# Altium schematic sheet FPGAPower.SchDoc
size 420 x 297 mm; Organization: Altium Limited; Address1: L3, 12a Rodborough Rd; Address2: Frenchs Forest; Address3: NSW; Address4: Australia 2086
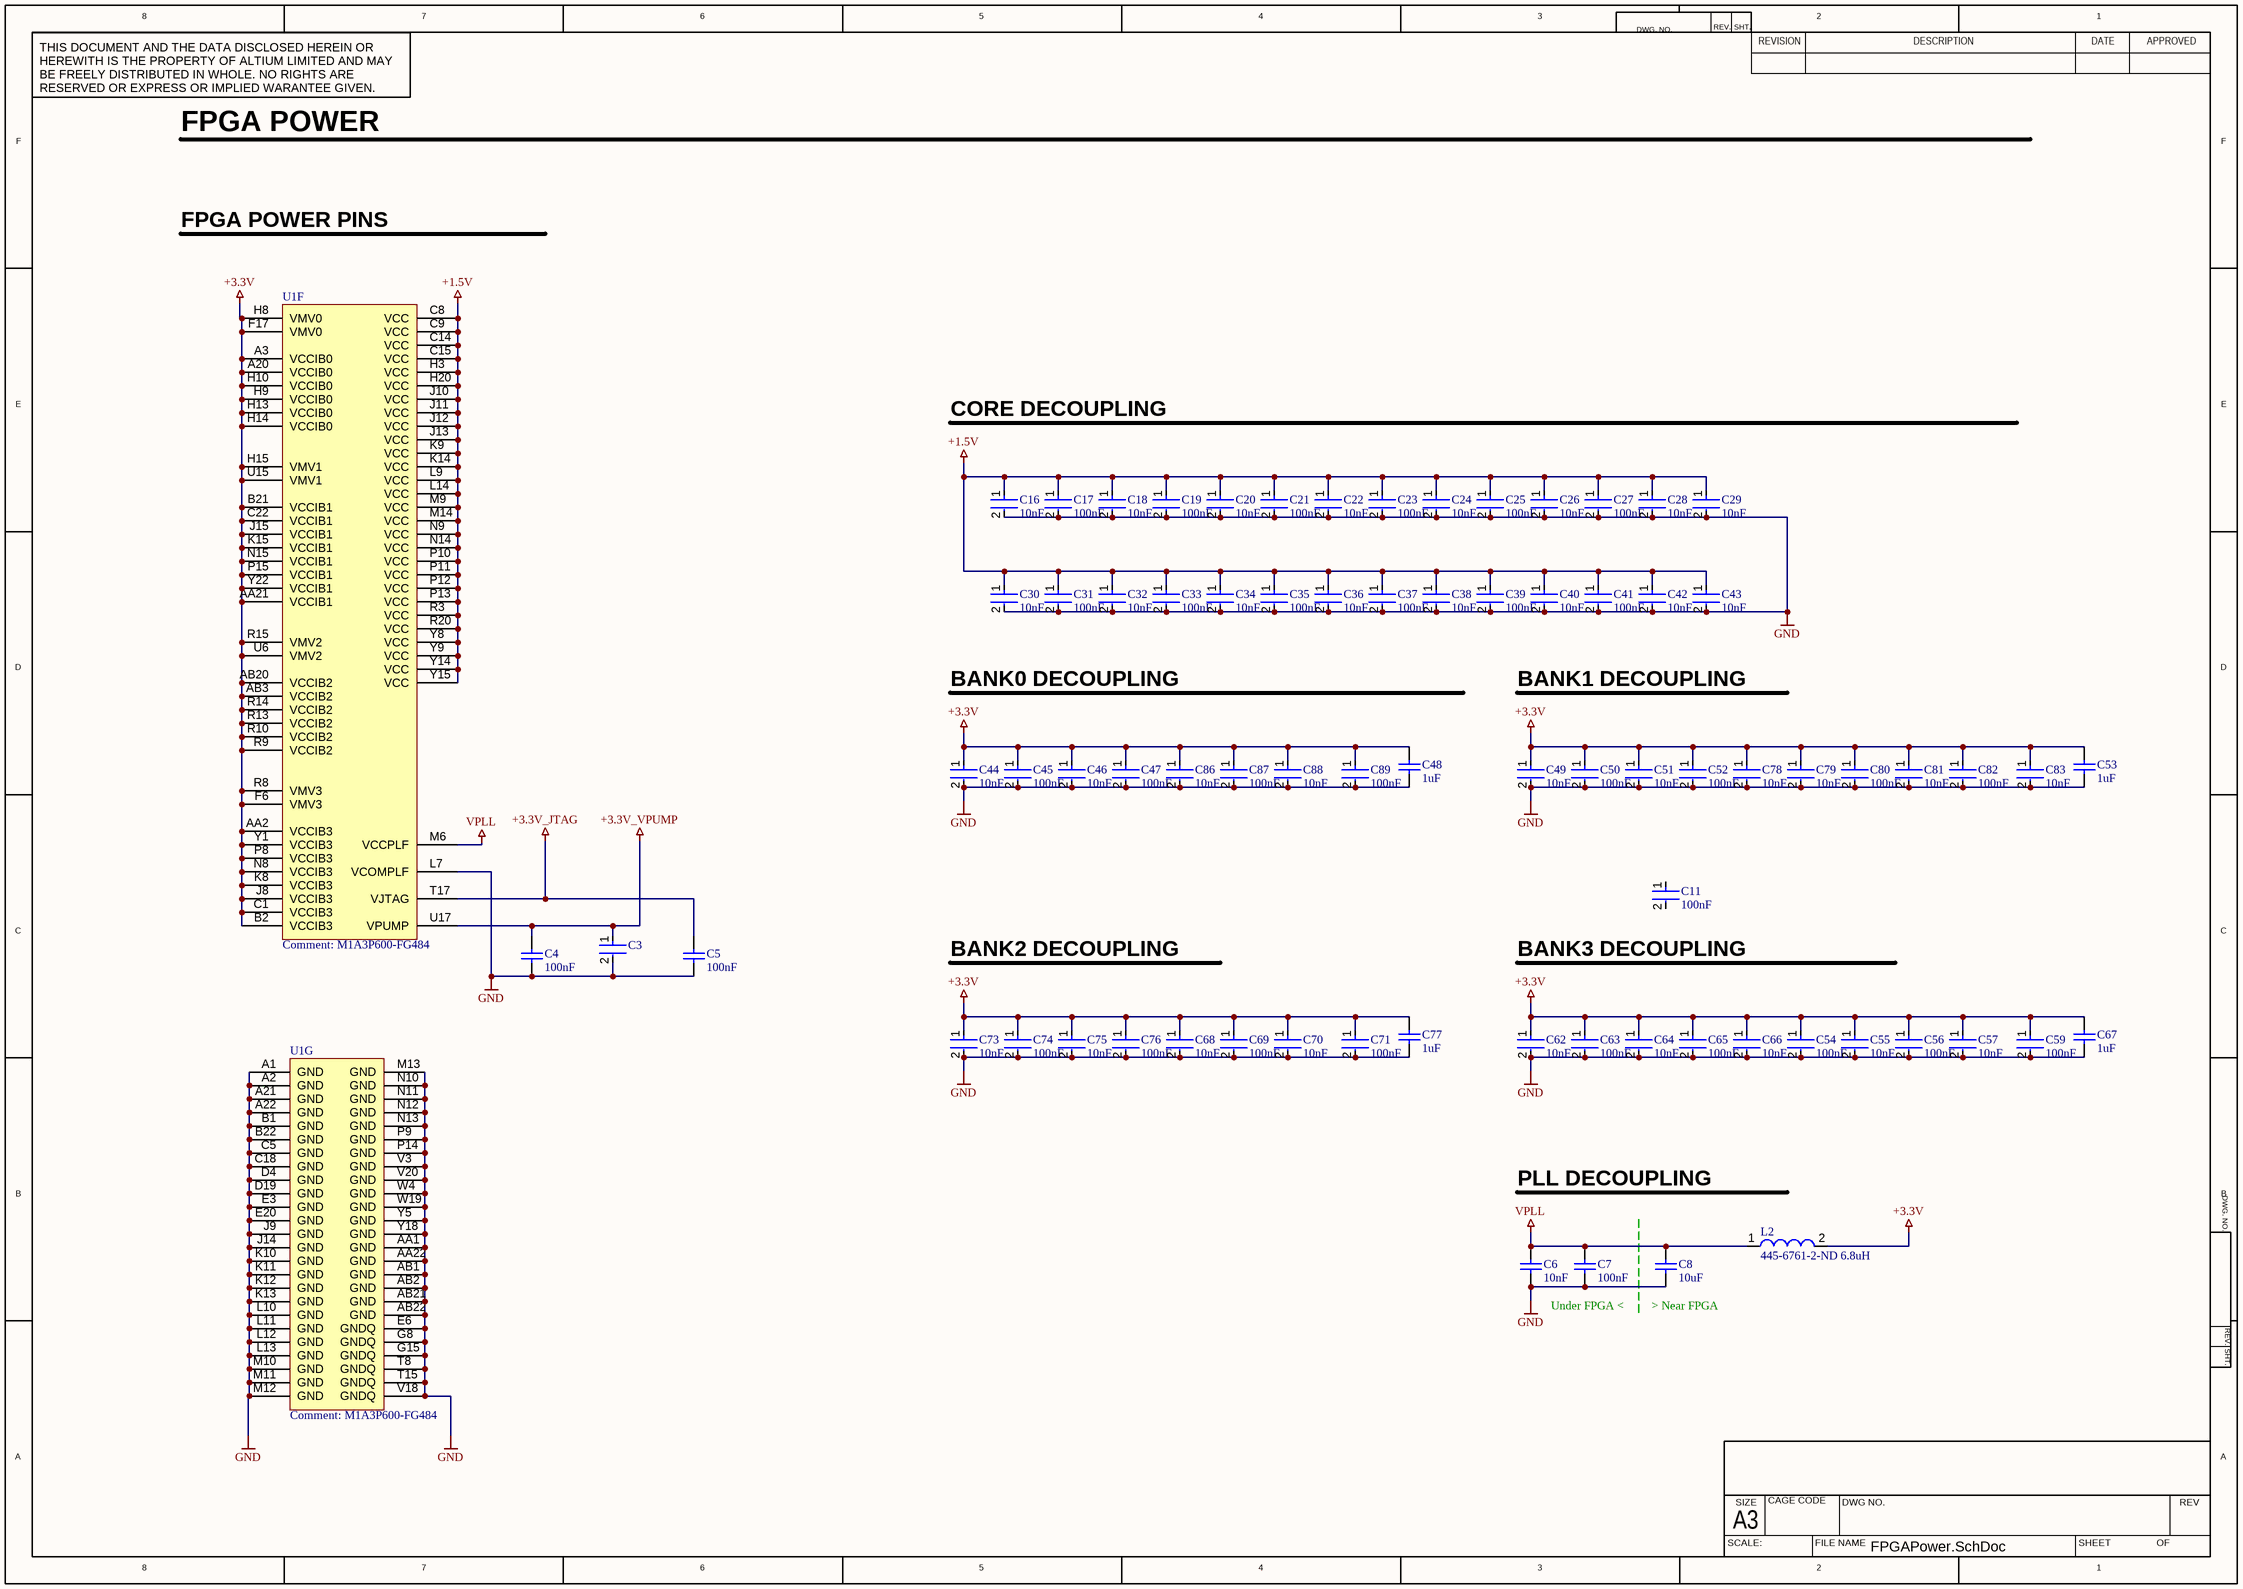
[diagram p0: FPGAPower.SchDoc]

## Parts
C3  CC0402KRX5R6BB334  [FP-CC0402-MFG]  (value not drawn)
C4  100nF  [CAPC1005X60X30ML05T10]
C5  100nF  [CAPC1005X60X30ML05T10]
C6  10nF  [CAPC0402(1005)60_M]
C7  100nF  [CAPC1005X60X30ML05T10]
C8  10uF  [CAPC2013X145X20ML20]
C11  100nF  [FP-GRM155-0_05-IPC_C]
C16  10nF  [FP-GRM155-0_05-IPC_C]
C17  100nF  [FP-GRM155-0_05-IPC_C]
C18  10nF  [FP-GRM155-0_05-IPC_C]
C19  100nF  [FP-GRM155-0_05-IPC_C]
C20  10nF  [FP-GRM155-0_05-IPC_C]
C21  100nF  [FP-GRM155-0_05-IPC_C]
C22  10nF  [FP-GRM155-0_05-IPC_C]
C23  100nF  [FP-GRM155-0_05-IPC_C]
C24  10nF  [FP-GRM155-0_05-IPC_C]
C25  100nF  [FP-GRM155-0_05-IPC_C]
C26  10nF  [FP-GRM155-0_05-IPC_C]
C27  100nF  [FP-GRM155-0_05-IPC_C]
C28  10nF  [FP-GRM155-0_05-IPC_C]
C29  10nF  [FP-GRM155-0_05-IPC_C]
C30  10nF  [FP-GRM155-0_05-IPC_C]
C31  100nF  [FP-GRM155-0_05-IPC_C]
C32  10nF  [FP-GRM155-0_05-IPC_C]
C33  100nF  [FP-GRM155-0_05-IPC_C]
C34  10nF  [FP-GRM155-0_05-IPC_C]
C35  100nF  [FP-GRM155-0_05-IPC_C]
C36  10nF  [FP-GRM155-0_05-IPC_C]
C37  100nF  [FP-GRM155-0_05-IPC_C]
C38  10nF  [FP-GRM155-0_05-IPC_C]
C39  100nF  [FP-GRM155-0_05-IPC_C]
C40  10nF  [FP-GRM155-0_05-IPC_C]
C41  100nF  [FP-GRM155-0_05-IPC_C]
C42  10nF  [FP-GRM155-0_05-IPC_C]
C43  10nF  [FP-GRM155-0_05-IPC_C]
C44  10nF  [FP-GRM155-0_05-IPC_C]
C45  100nF  [FP-GRM155-0_05-IPC_C]
C46  10nF  [FP-GRM155-0_05-IPC_C]
C47  100nF  [FP-GRM155-0_05-IPC_C]
C48  1uF  [CAPC1608X90X20LL10]
C49  10nF  [FP-GRM155-0_05-IPC_C]
C50  100nF  [FP-GRM155-0_05-IPC_C]
C51  10nF  [FP-GRM155-0_05-IPC_C]
C52  100nF  [FP-GRM155-0_05-IPC_C]
C53  1uF  [CAPC1608X90X20LL10]
C54  100nF  [FP-GRM155-0_05-IPC_C]
C55  10nF  [FP-GRM155-0_05-IPC_C]
C56  100nF  [FP-GRM155-0_05-IPC_C]
C57  10nF  [FP-GRM155-0_05-IPC_C]
C59  100nF  [FP-GRM155-0_05-IPC_C]
C62  10nF  [FP-GRM155-0_05-IPC_C]
C63  100nF  [FP-GRM155-0_05-IPC_C]
C64  10nF  [FP-GRM155-0_05-IPC_C]
C65  100nF  [FP-GRM155-0_05-IPC_C]
C66  10nF  [FP-GRM155-0_05-IPC_C]
C67  1uF  [CAPC1608X90X20LL10]
C68  10nF  [FP-GRM155-0_05-IPC_C]
C69  100nF  [FP-GRM155-0_05-IPC_C]
C70  10nF  [FP-GRM155-0_05-IPC_C]
C71  100nF  [FP-GRM155-0_05-IPC_C]
C73  10nF  [FP-GRM155-0_05-IPC_C]
C74  100nF  [FP-GRM155-0_05-IPC_C]
C75  10nF  [FP-GRM155-0_05-IPC_C]
C76  100nF  [FP-GRM155-0_05-IPC_C]
C77  1uF  [CAPC1608X90X20LL10]
C78  10nF  [FP-GRM155-0_05-IPC_C]
C79  10nF  [FP-GRM155-0_05-IPC_C]
C80  100nF  [FP-GRM155-0_05-IPC_C]
C81  10nF  [FP-GRM155-0_05-IPC_C]
C82  100nF  [FP-GRM155-0_05-IPC_C]
C83  10nF  [FP-GRM155-0_05-IPC_C]
C86  10nF  [FP-GRM155-0_05-IPC_C]
C87  100nF  [FP-GRM155-0_05-IPC_C]
C88  10nF  [FP-GRM155-0_05-IPC_C]
C89  100nF  [FP-GRM155-0_05-IPC_C]
L2  445-6761-2-ND 6.8uH  [SMD-0805]
U1  M1A3P600-FG484  [FG484]  (parts F,G of 8)

## Nets
+1.5V: C16.1 C17.1 C18.1 C19.1 C20.1 C21.1 C22.1 C23.1 C24.1 C25.1 C26.1 C27.1 C28.1 C29.1 C30.1 C31.1 C32.1 C33.1 C34.1 C35.1 C36.1 C37.1 C38.1 C39.1 C40.1 C41.1 C42.1 C43.1 U1.C8(VCC) U1.C9(VCC) U1.C14(VCC) U1.C15(VCC) U1.H3(VCC) U1.H20(VCC) U1.J10(VCC) U1.J11(VCC) U1.J12(VCC) U1.J13(VCC) U1.K9(VCC) U1.K14(VCC) U1.L9(VCC) U1.L14(VCC) U1.M9(VCC) U1.M14(VCC) U1.N9(VCC) U1.N14(VCC) U1.P10(VCC) U1.P11(VCC) U1.P12(VCC) U1.P13(VCC) U1.R3(VCC) U1.R20(VCC) U1.Y8(VCC) U1.Y9(VCC) U1.Y14(VCC) U1.Y15(VCC)
+3.3V: C44.1 C45.1 C46.1 C47.1 C48.2 C49.1 C50.1 C51.1 C52.1 C53.2 C54.1 C55.1 C56.1 C57.1 C59.1 C62.1 C63.1 C64.1 C65.1 C66.1 C67.2 C68.1 C69.1 C70.1 C71.1 C73.1 C74.1 C75.1 C76.1 C77.2 C78.1 C79.1 C80.1 C81.1 C82.1 C83.1 C86.1 C87.1 C88.1 C89.1 L2.2 U1.A3(VCCIB0) U1.A20(VCCIB0) U1.AA2(VCCIB3) U1.AA21(VCCIB1) U1.AB3(VCCIB2) U1.AB20(VCCIB2) U1.B2(VCCIB3) U1.B21(VCCIB1) U1.C1(VCCIB3) U1.C22(VCCIB1) U1.F6(VMV3) U1.F17(VMV0) U1.H8(VMV0) U1.H9(VCCIB0) U1.H10(VCCIB0) U1.H13(VCCIB0) U1.H14(VCCIB0) U1.H15(VMV1) U1.J8(VCCIB3) U1.J15(VCCIB1) U1.K8(VCCIB3) U1.K15(VCCIB1) U1.N8(VCCIB3) U1.N15(VCCIB1) U1.P8(VCCIB3) U1.P15(VCCIB1) U1.R8(VMV3) U1.R9(VCCIB2) U1.R10(VCCIB2) U1.R13(VCCIB2) U1.R14(VCCIB2) U1.R15(VMV2) U1.U6(VMV2) U1.U15(VMV1) U1.Y1(VCCIB3) U1.Y22(VCCIB1)
+3.3V_JTAG: C5.2 U1.T17(VJTAG)
+3.3V_VPUMP: C3.1 C4.2 U1.U17(VPUMP)
GND: C3.2 C4.1 C5.1 C6.1 C7.1 C8.1 C16.2 C17.2 C18.2 C19.2 C20.2 C21.2 C22.2 C23.2 C24.2 C25.2 C26.2 C27.2 C28.2 C29.2 C30.2 C31.2 C32.2 C33.2 C34.2 C35.2 C36.2 C37.2 C38.2 C39.2 C40.2 C41.2 C42.2 C43.2 C44.2 C45.2 C46.2 C47.2 C48.1 C49.2 C50.2 C51.2 C52.2 C53.1 C54.2 C55.2 C56.2 C57.2 C59.2 C62.2 C63.2 C64.2 C65.2 C66.2 C67.1 C68.2 C69.2 C70.2 C71.2 C73.2 C74.2 C75.2 C76.2 C77.1 C78.2 C79.2 C80.2 C81.2 C82.2 C83.2 C86.2 C87.2 C88.2 C89.2 U1.A1(GND) U1.A2(GND) U1.A21(GND) U1.A22(GND) U1.AA1(GND) U1.AA22(GND) U1.AB1(GND) U1.AB2(GND) U1.AB21(GND) U1.AB22(GND) U1.B1(GND) U1.B22(GND) U1.C5(GND) U1.C18(GND) U1.D4(GND) U1.D19(GND) U1.E3(GND) U1.E6(GNDQ) U1.E20(GND) U1.G8(GNDQ) U1.G15(GNDQ) U1.J9(GND) U1.J14(GND) U1.K10(GND) U1.K11(GND) U1.K12(GND) U1.K13(GND) U1.L7(VCOMPLF) U1.L10(GND) U1.L11(GND) U1.L12(GND) U1.L13(GND) U1.M10(GND) U1.M11(GND) U1.M12(GND) U1.M13(GND) U1.N10(GND) U1.N11(GND) U1.N12(GND) U1.N13(GND) U1.P9(GND) U1.P14(GND) U1.T8(GNDQ) U1.T15(GNDQ) U1.V3(GND) U1.V18(GNDQ) U1.V20(GND) U1.W4(GND) U1.W19(GND) U1.Y5(GND) U1.Y18(GND)
VPLL: C6.2 C7.2 C8.2 L2.1 U1.M6(VCCPLF)

Not connected (* = marked no-connect by the designer): C11 1 2

## Notes on the sheet
- FPGA POWER
- FPGA POWER PINS
- CORE DECOUPLING
- BANK0 DECOUPLING
- BANK1 DECOUPLING
- BANK2 DECOUPLING
- (near C11) BANK3 DECOUPLING
- PLL DECOUPLING
- Under FPGA <
- (near C8) > Near FPGA
- 8
- 7
- 6
- 5
- 4
- 3
- DWG. NO.
- REV.
- SHT.
- REVISION
- 2
- DESCRIPTION
- DATE
- 1
- APPROVED
- THIS DOCUMENT AND THE DATA DISCLOSED HEREIN OR HEREWITH IS THE PROPERTY OF ALTIUM LIMITED AND MAY BE FREELY DISTRIBUTED IN WHOLE. NO RIGHTS ARE RESERVED OR EXPRESS OR IMPLIED WARANTEE GIVEN.
- F
- E
- D
- C
- B
- A
- SCALE:
- A3
- SIZE
- CAGE CODE
- FILE NAME
- DWG NO.
- SHEET
- OF
- REV

## Library data of the parts
C3 = CMP-03422-001340-1: CAP CER 0.33UF 10V X5R 0402; Manufacturer: YAGEO; Automotive Grade: NA; Value: 330 nF; Temperature Coefficient: 30ppm/°C; Material: Ceramic; Tolerance: 0.1; ComponentLink2URL: http://www.yageo.com/documents/recent/UPY-GP_NP0_16V-to-50V_16.pdf; Device Class L2: Capacitors; Voltage Rating: 10 V; ComponentLink2Description: Datasheet; Package: CC0402; Device Class L3: Ceramic Capacitors; Digikey Description: CAP CER 0.33UF 10V X5R 0402; Device Class L1: Passive Components; Footprint Url: http://www.yageo.com/exep/pages/download/literatures/UPY-C_GEN_24.pdf; Temperature Characteristic: X5R; Octopart: https://octopart.com/cc0402krx5r6bb334-yageo-21548561; Automotive: No; Temperature: -55°C to +125°C; Lead Free: Yes; Temperature Range Low: -55°C; Height: 0.55mm; Ipc Land Pattern Name: CAPC10050X50; Category: Cap; Capacitance: 330 nF; Manufacturer Part Number: CC0402KRX5R6BB334; RoHS: TRUE; Mouser Description: 0402 330 nF 10 V ±10 % Tolerance X5R SMT Multilayer Ceramic Capacitor; Temperature Range High: +125°C
C4 C5 C7 = CMP-2008-02046-1: Manufacturer: Kemet; Part Number: C0402C104K8PACTU
C6 = CMP-1034-01878-1: CAP 10nF 16V -20% to +80% 0402 (1005 Metric) Thickness 0.6mm SMD; Case-Metric: 1005; Case-EIA: 0402; Rated Voltage: 16 V; Max Thickness: 0.6 mm; Tolerance: -20% to +80%; Value: 10nF; Technology: SMT
C8 = CMP-2000-05452-1: Multilayer Ceramic Chip Capacitor, 10 uF, +/- 10%, 10 V, -55 to 125 degC, 0805 (2012 Metric), RoHS, Tape and Reel; Manufacturer: TDK; PCN Part Number: MLCCPartNumberChange30/Nov/2012; Capacitance: 10µF; Voltage - Rated: 10V; Product Training Modules: CSeriesGeneralApplicationsSEAT,CCV,andTVCLDesignToolsGuidetoReplacinganElectrolyticCapacitorwithanMLCC; Online Catalog: CSeries,GeneralPurpose; Other Names: 445-6857-6; Temperature Coefficient: X7R; Features: -; Ratings: -; Operating Temperature: -55degC~125degC; RoHS Information: RoHSCertificate-MLCC; Datasheet Version: Mar-15; Package / Case: 0805(2012Metric); Series: C; Mounting Type: SurfaceMount,MLCC; Family: CeramicCapacitors; Height - Seated (Max): -; Manufacturer URL: http://www.tdk.com/; Packaging: Digi-Reel; Tolerance: ±10%; Category: Capacitors; Applications: GeneralPurpose; Standard Package: 1; Size / Dimension: 0.079"Lx0.049"W(2.00mmx1.25mm); Datasheet URL: http://download.siliconexpert.com/pdfs/2015/4/21/15/54/45/779/tdk_/manual/37024850441143360mlcc_commercial_general_en.pdf; Lead Style: -; Lead Spacing: -; Thickness (Max): 0.057"(1.45mm); Package Reference: 805; Package Description: 2-Pin Surface Mount Device, Body 2 x 1.25 mm
C11 C17 C19 C21 C23 C25 C27 C31 C33 C35 C37 C39 C41 C45 C47 C50 C52 C54 C56 C59 C63 C65 C69 C71 C74 C76 C80 C82 C87 C89 = CMP-2008-04637-5: Chip Multilayer Ceramic Capacitors for General Purpose, 0402, 10000pF, X7R, 15%, 10%, 50V GRM155R71H103KA88D; Voltage: 25V; Capacitance: 10nF; Tolerance: 10%; Mount: Surface Mount; Lead Free: Lead Free; Radiation Hardening: No; Case Code (Imperial): 0402; REACH SVHC: No SVHC; Case/Package: 0402; Dielectric: X7R; Voltage Rating (DC): 50V; Max Operating Temperature: 125°C; Termination: SMD/SMT; Material: Ceramic; Width: 0.02inch; Package Quantity: 1; Voltage Rating: 50V; Thickness: 0.022inch; Packaging: Tape and Reel; Height: 0.5mm; Number of Pins: 2; Case Code (Metric): 1005; Min Operating Temperature: -55°C; Length: 1mm; Depth: 0.5mm
C16 C18 C20 C22 C24 C26 C28-C30 C32 C34 C36 C38 C40 C42-C44 C46 C49 C51 C55 C57 C62 C64 C66 C68 C70 C73 C75 C78 C79 C81 C83 C86 C88 = CMP-2008-04637-5: Chip Multilayer Ceramic Capacitors for General Purpose, 0402, 10000pF, X7R, 15%, 10%, 50V GRM155R71H103KA88D; Voltage: 25V; Tolerance: 10%; Mount: Surface Mount; Lead Free: Lead Free; Radiation Hardening: No; Case Code (Imperial): 0402; REACH SVHC: No SVHC; Case/Package: 0402; Dielectric: X7R; Voltage Rating (DC): 50V; Max Operating Temperature: 125°C; Termination: SMD/SMT; Material: Ceramic; Width: 0.02inch; Package Quantity: 1; Voltage Rating: 50V; Thickness: 0.022inch; Packaging: Tape and Reel; Height: 0.5mm; Number of Pins: 2; Case Code (Metric): 1005; Min Operating Temperature: -55°C; Length: 1mm; Capacitance: 10nF; Depth: 0.5mm
C48 C53 C67 C77 = CMP-2000-06025-1: Chip Capacitor, 1 uF, +/- 10%, 50 V, -55 to 85 degC, 0603 (1608 Metric), RoHS, Tape and Reel; Manufacturer: TDK; PCN Part Number: MLCCPartNumberChange30/Nov/2012; Other Names: 445-7468-6; Online Catalog: CSeries,GeneralPurpose; Capacitance: 1µF; Product Training Modules: CSeriesGeneralApplicationsSEAT,CCV,andTVCLDesignToolsGuidetoReplacinganElectrolyticCapacitorwithanMLCC; Voltage - Rated: 50V; Design Resources: 20WNon-IsolatedBuckLEDDriverUsingPLLNK460KG; Temperature Coefficient: X5R; Series: C; Datasheet Version: 08/2016; Package Description: 2-Pin Surface Mount Device, Body 1.6 x 0.8 mm; Mounting Technology: SurfaceMount; Features: -; Size / Dimension: 0.063"Lx0.031"W(1.60mmx0.80mm); Lead Spacing: -; Operating Temperature: -55°C~85°C; Tolerance: ±10%; Height - Seated (Max): -; Mounting Type: SurfaceMount,MLCC; Ratings: -; Standard Package: 1; Applications: GeneralPurpose; Datasheet URL: https://product.tdk.com/info/en/catalog/datasheets/mlcc_commercial_general_en.pdf; Category: Capacitors; Lead Style: -; Packaging: Digi-Reel®; RoHS Information: RoHSCertificate-MLCC; Package / Case: 0603(1608Metric); Package Reference: 0603; Manufacturer URL: http://www.tdk.com/; Thickness (Max): 0.035"(0.90mm); Family: CeramicCapacitors
L2 = CMP-0221-00012-1: SMD-Multilayer Inductor WE-MI, L = 1.00 µH; Inductance: 1.00 ÂµH; ComponentLink2URL: http://www.we-online.de/katalog/media/pdf/7447905.pdf; ComponentLink1Description: Manufacturer Link; ComponentLink2Description: Datasheet; DatasheetVersion: ver 4, Oct-2004; PackageVersion: 2005; PackageReference: SMD-0805; ComponentLink1URL: http://www.we-online.com; PackageDescription: Chip Inductor, 2-Leads, Body 2.0 x 1.2 mm
U1 = CMP-0097-00007-1: M1-Ready ProASIC3 Flash Family FPGA, 235 User IOs, 600K System Gates, 108 Kbits RAM, 1 Kbit Flash ROM, 1 PLL, 484-Ball FBGA, Commercial Grade; Code_JEDEC: MS-034-AAJ-1; PackageDescription: 484-Ball Fine Pitch Plastic Ball Grid Array (FG484) - Fully Populated; DatasheetVersion: v1.3, Oct-2009; PackageReference: FG484; PackageVersion: ver11.2, Nov-2009; Code_IPC: BGA100P22X22-484